# EAGLE design Un_AVR (EAGLE 6.5.0)
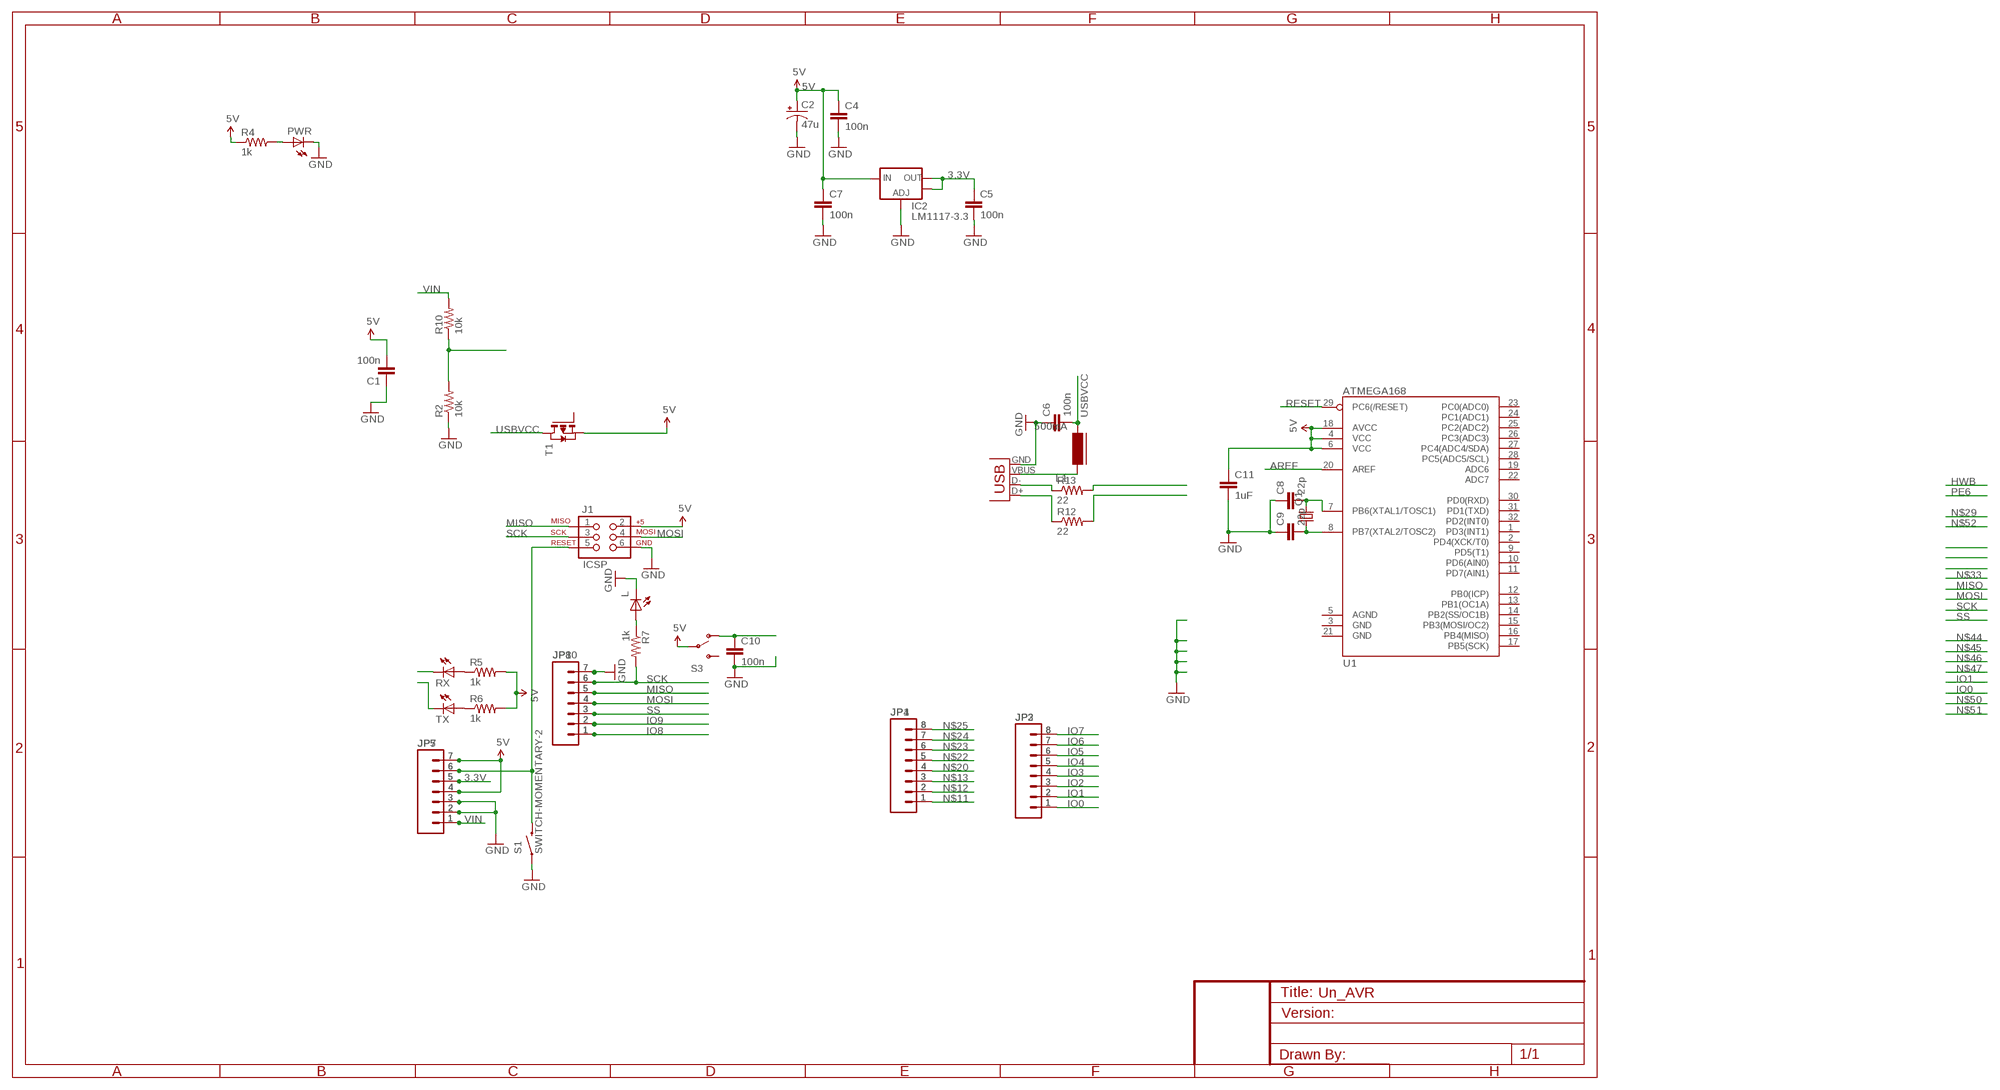
[diagram p0: schematic, sheet 1]

## Parts
C1  100n  CAP0603-CAP  [0603-CAP]
C2  47u  CAP_POLD  [PANASONIC_D]
C4  100n  CAP0603-CAP  [0603-CAP]
C5  100n  CAP0603-CAP  [0603-CAP]
C6  100n  CAP0603-CAP  [0603-CAP]
C7  100n  CAP0603-CAP  [0603-CAP]
C8  22p  CAP0603-CAP  [0603-CAP]
C9  22p  CAP0603-CAP  [0603-CAP]
C10  100n  CAP0603-CAP  [0603-CAP]
C11  1uF  CAP0603-CAP  [0603-CAP]
IC2  LM1117-3.3  V_REG_LM1117SOT223  [SOT223]
J1  ICSP  AVR_SPI_PRG_6PTH  [2X3]
JP1  M081X08  [1X08]
JP2  M081X08  [1X08]
JP3  M081X08  [1X08]
JP4  M081X08  [1X08]
JP5  M07  [1X07]
JP7  M07  [1X07]
JP8  M07  [1X07]
JP10  M07  [1X07]
L  LED0805  [LED-0805]
L1  500mA  FERRITE-0805  [FB805]
PWR  LED0805  [LED-0805]
Q1  CRYSTALHC49US  [HC49US]
R2  10k  RESISTOR0805-RES  [0805]
R4  1k  RESISTOR0805-RES  [0805]
R5  1k  RESISTOR0805-RES  [0805]
R6  1k  RESISTOR0805-RES  [0805]
R7  1k  RESISTOR0805-RES  [0805]
R10  10k  RESISTOR0805-RES  [0805]
R12  22  RESISTOR0805-RES  [0805]
R13  22  RESISTOR0805-RES  [0805]
RX  LED0805  [LED-0805]
S1  SWITCH-MOMENTARY-2  [TACTILE_SWITCH_TALL]
S3  SWITCH-SPSTPTH  [SWITCH-SPDT]
T1  PMOSSOT23  [SOT-23]
TX  LED0805  [LED-0805]
U1  ATMEGA168  [TQFP32-08]
X1  USBSMD  [USB-MINIB]

## Nets
3.3V: C5.1 IC2.2(OUT) IC2.4(OUT) JP5.5 JP7.5
5V: C1.2 C2.+ C4.1 C7.1 C11.1 IC2.3(IN) J1.2 JP5.4 JP5.7 JP7.4 JP7.7 R4.1 R5.2 R6.2 S3.2(P) T1.2(S) U1.4(VCC) U1.6(VCC) U1.18(AVCC)
AREF: U1.20(AREF)
GND [gnd]: C1.1 C2.- C4.2 C5.2 C6.1 C7.2 C8.1 C9.1 C10.2 C11.2 IC2.1(ADJ) J1.6 JP5.2 JP5.3 JP7.2 JP7.3 JP8.7 JP10.7 L.2(C) PWR.2(C) R2.1 S1.A2 X1.GND
IO0: JP2.1 JP3.1
IO1: JP2.2 JP3.2
IO2: JP2.3 JP3.3
IO3: JP2.4 JP3.4
IO4: JP2.5 JP3.5
IO5: JP2.6 JP3.6
IO6: JP2.7 JP3.7
IO7: JP2.8 JP3.8
IO8: JP8.1 JP10.1
IO9: JP8.2 JP10.2
MISO: J1.1 JP8.5 JP10.5
MOSI: J1.4 JP8.4 JP10.4
N$1: R2.2 R10.1
N$3: L1.1 X1.VBUS
N$5: R13.1 X1.D-
N$6: R13.2
N$7: R5.1 RX.1(A)
N$8: R6.1 TX.1(A)
N$9: RX.2(C)
N$10: TX.2(C)
N$11: JP1.1 JP4.1
N$12: JP1.2 JP4.2
N$13: JP1.3 JP4.3
N$14: L.1(A) R7.1
N$15: C10.1 S3.1(O)
N$18: R12.2
N$19: R12.1 X1.D+
N$20: JP1.4 JP4.4
N$22: JP1.5 JP4.5
N$23: JP1.6 JP4.6
N$24: JP1.7 JP4.7
N$25: JP1.8 JP4.8
N$34: PWR.1(A) R4.2
N$38: J1.5 JP5.6 JP7.6 S1.B2
N$39: C8.2 Q1.2 U1.7(PB6(XTAL1/TOSC1))
N$40: C9.2 Q1.1
RESET: U1.29(PC6(/RESET))
SCK: J1.3 JP8.6 JP10.6 R7.2
SS: JP8.3 JP10.3
USBVCC: C6.2 L1.2 T1.1(D)
VIN: JP5.1 JP7.1 R10.2
Unconnected: S3.3(S) T1.3(G) U1.1(PD3(INT1)) U1.2(PD4(XCK/T0)) U1.3(GND) U1.5(AGND) U1.8(PB7(XTAL2/TOSC2)) U1.9(PD5(T1)) U1.10(PD6(AIN0)) U1.11(PD7(AIN1)) U1.12(PB0(ICP)) U1.13(PB1(OC1A)) U1.14(PB2(SS/OC1B)) U1.15(PB3(MOSI/OC2)) U1.16(PB4(MISO)) U1.17(PB5(SCK)) U1.19(ADC6) U1.21(GND) U1.22(ADC7) U1.23(PC0(ADC0)) U1.24(PC1(ADC1)) U1.25(PC2(ADC2)) U1.26(PC3(ADC3)) U1.27(PC4(ADC4/SDA)) U1.28(PC5(ADC5/SCL)) U1.30(PD0(RXD)) U1.31(PD1(TXD)) U1.32(PD2(INT0))

## Library data of the parts
C1 C4-C11 = 2SparkFun:CAP: Capacitor Standard 0603 ceramic capacitor, and 0.1" leaded capacitor.
C2 = 1SparkFun:CAP_POL: Capacitor Polarized These are standard SMD and PTH capacitors. Normally 10uF, 47uF, and 100uF in electrolytic and tantalum varieties. Always verify the external diameter of the through hole cap, it varies with capacity, voltage, and manufacturer. The EIA devices should be standard.
IC2 = 1SparkFun:V_REG_LM1117: Voltage Regulator LM1117 Standard adjustable voltage regulator but in SMD form. Spark Fun Electronics SKU : COM-00595
J1 = 1SparkFun:AVR_SPI_PRG_6: AVR ISP 6 Pin This is the reduced ISP connector for AVR programming. Common on Arduino. This footprint will take up less PCB space and can be used with a 10-pin to 6-pin adapter such as SKU: BOB-08508
JP1-JP4 = 2SparkFun:M08: Header 8 Standard 8-pin 0.1" header. Use with straight break away headers (SKU : PRT-00116), right angle break away headers (PRT-00553), swiss pins (PRT-00743), machine pins (PRT-00117), and female headers (PRT-00115).
JP5 JP7 JP8 JP10 = 2SparkFun:M07: Header 7 Standard 7-pin 0.1" header. Use with straight break away headers (SKU : PRT-00116), right angle break away headers (PRT-00553), swiss pins (PRT-00743), machine pins (PRT-00117), and female headers (PRT-00115). NOTES ON THE VARIANTS LOCK and LOCK_LONGPADS... This footprint was designed to help hold the alignment of a through-hole component (i.e. 7-pin header) while soldering it into place. You may notice that each hole has been shifted either up or down by 0.005 of an inch from it's more standard position (which is usually a perfectly straight line). This slight alteration caused the pins (the squares in the middle) to touch the edges of the holes. Because they are alternating, it causes a "brace" to hold the header in place. 0.005 has proven to be the perfect amount of "off-center" position when using our standard breakaway headers. Although looks a little odd when you look at the bare footprint, once you have a header in there, the alteration is very hard to notice. Also, if you push a header all the way into place, it is covered up entirely on the bottom side. This idea of altering the position of holes to aid alignment will be further integrated into the Sparkfun Library for other footprints. It can help hold any component with 3 or more connection pins.
L PWR RX TX = 1SparkFun:LED: LEDs Standard schematic elements and footprints for 5mm, 3mm, 1206, and 0603 sized LEDs. 5mm - Spark Fun Electronics SKU : COM-00529 (and others)
L1 = 2SparkFun:FERRITE: Ferrite bead in various packages
Q1 = 1SparkFun:CRYSTAL: Crystals Various standard crystals. Proven footprints. Spark Fun Electronics SKU : COM-00534
R2 R4-R7 R10 R12 R13 = 2SparkFun:RESISTOR: Resistor Basic schematic elements and footprints for 0603, 1206, and PTH resistors.
S1 = 2SparkFun:SWITCH-MOMENTARY-2
S3 = 2SparkFun:SWITCH-SPST: SPST Switch Simple slide switch. Spark Fun Electronics SKU : COM-00102
T1 = zetex:PMOSSOT23: MOS FET; OC_FARNELL: unknown; OC_NEWARK: unknown
U1 = 2SparkFun:ATMEGA168
X1 = 2SparkFun:USB: USB Connectors USB-B-PTH is fully proven SKU : PRT-00139 USB-miniB is fully proven SKU : PRT-00587 USB-A-PCB is untested. USB-A-H is throughly reviewed, but untested. Spark Fun Electronics SKU : PRT-00437 USB-B-SMT is throughly reviewed, but untested. Needs silkscreen touching up. USB-A-S has not been used/tested USB-MB-H has not been used/tested

## Net classes
0 default: width 0.254 mm, clearance 0.254 mm
1 power: width 0.61 mm, drill 0.61 mm, clearance 0.254 mm
2 gnd: width 0.305 mm, drill 0.559 mm, clearance 0.254 mm
3 usbvcc: width 0.508 mm, drill 0.61 mm, clearance 0.254 mm
4 aref: width 0.406 mm, drill 0.61 mm, clearance 0.254 mm

## Board
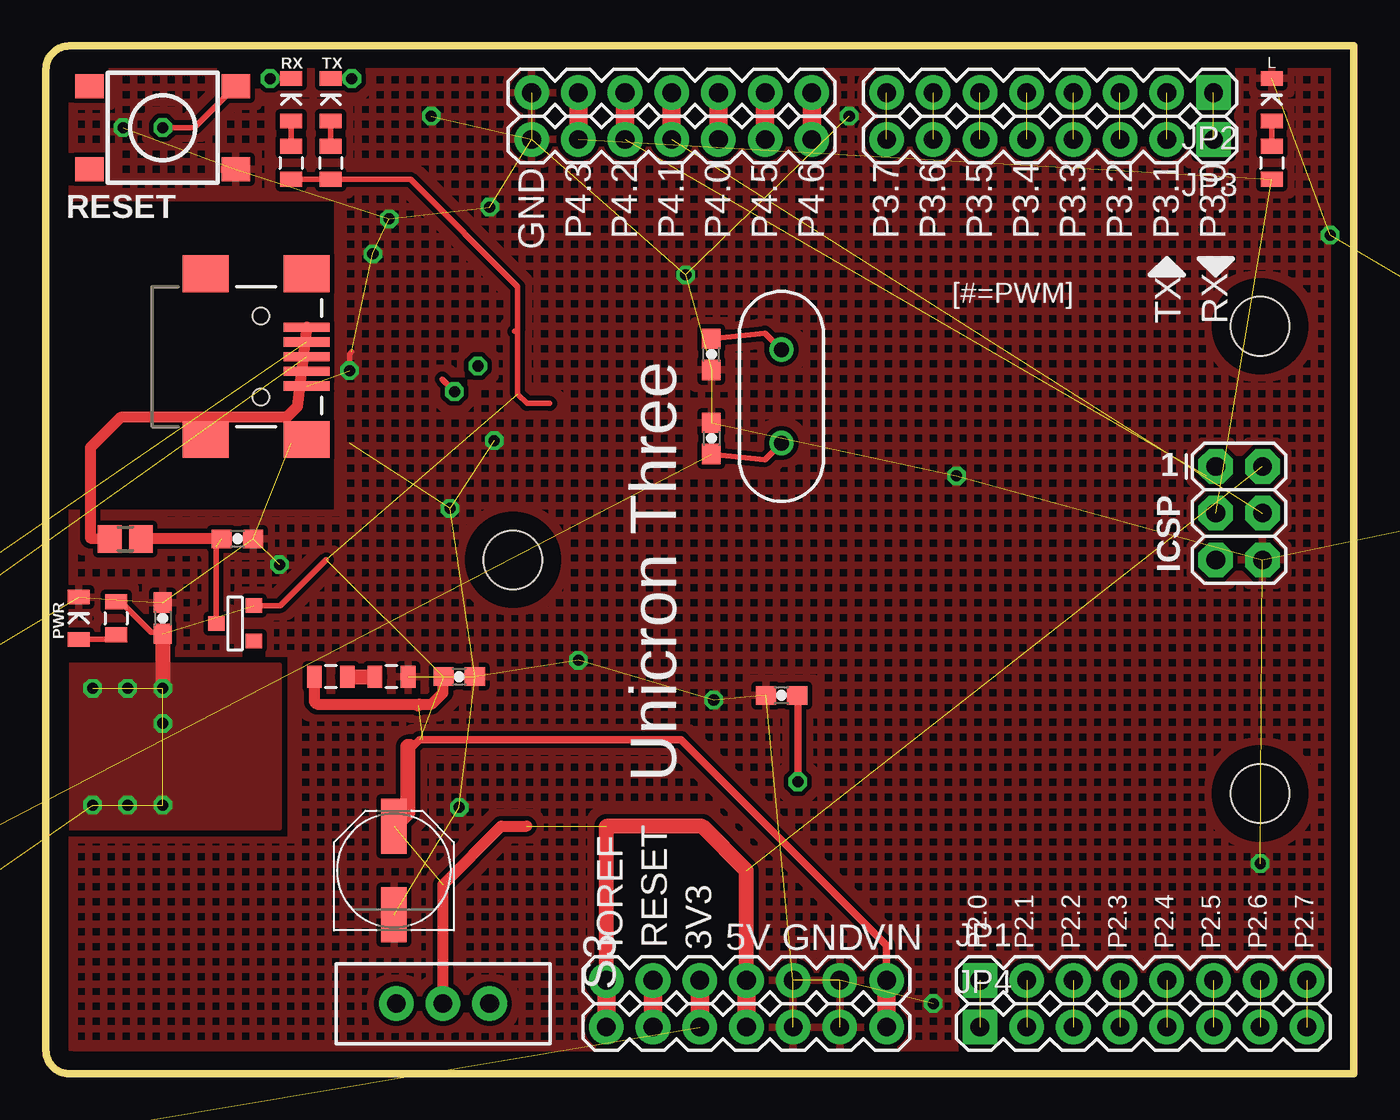
[diagram p1: board, top side]
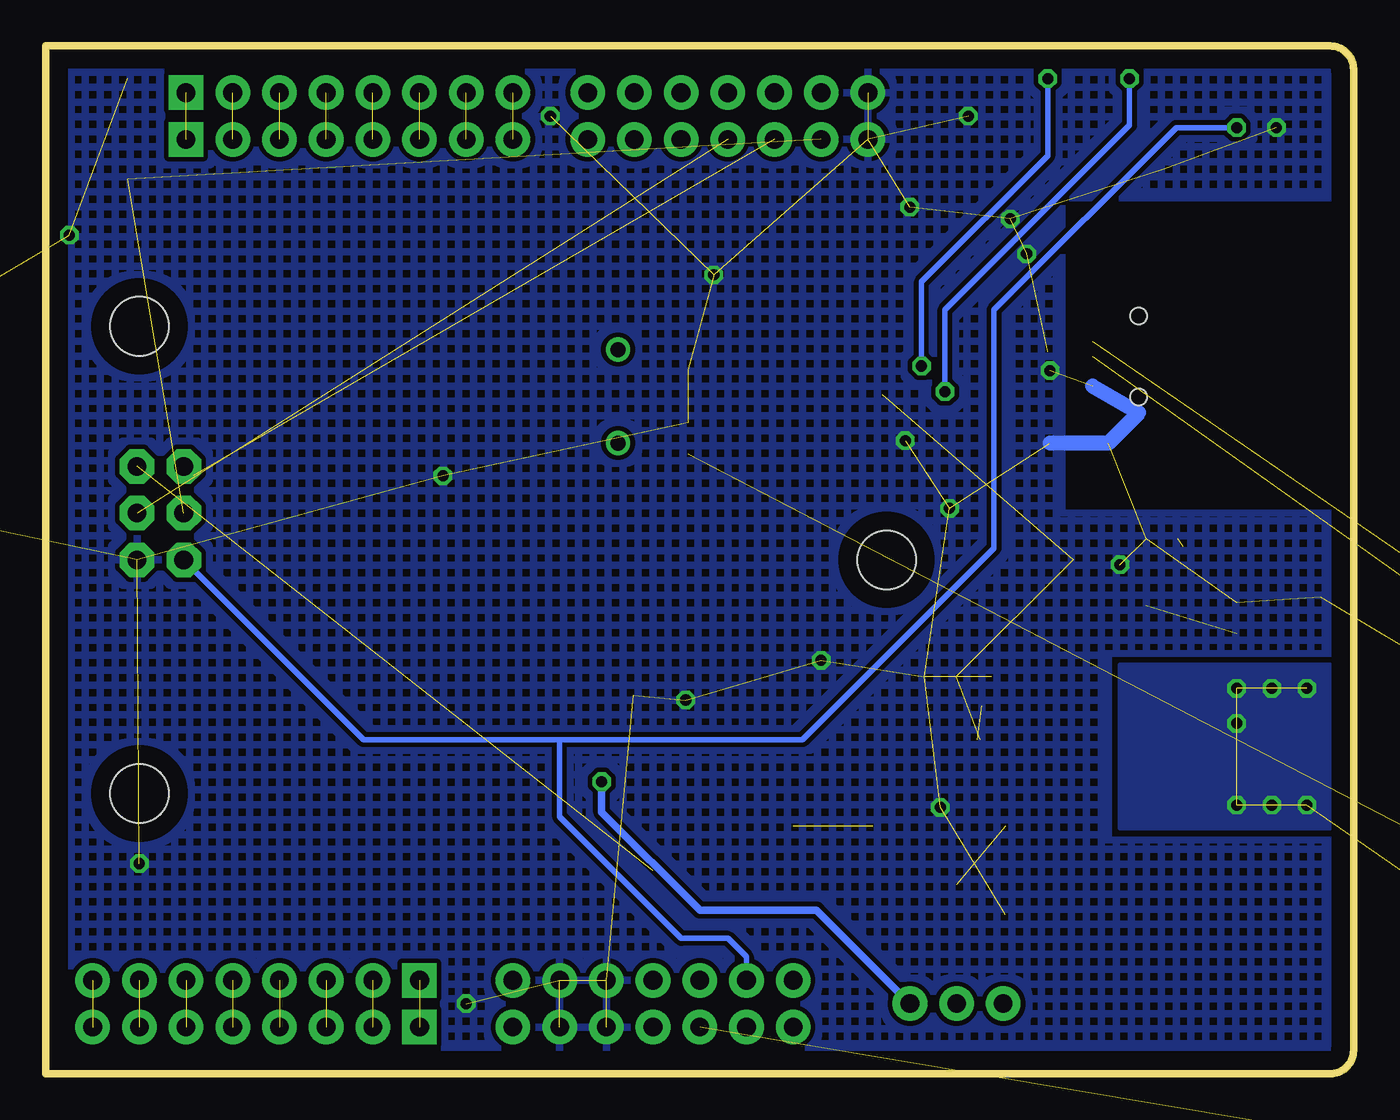
[diagram p2: board, bottom side, seen from below]

Size 71.12 x 55.88 mm. Coordinates in mm from the lower left corner, seen from the top.
Outline: 1.27,0 71.12,0 71.12,55.88 1.27,55.88 arc90 0,54.61 0,1.27 arc90 1.27,0
Copper layers (1*16): Top 0.035mm / dielectric 1.5mm / Bottom 0.035mm
Design rules "default": minimum track width 10mil, minimum drill 24mil, track to track 8mil, track to pad 8mil, pad to pad 8mil, via to via 8mil, smd to smd 8mil, copper to edge 40mil, drill to drill 8mil, minimum pad ring 10mil, minimum via ring 8mil, stop-mask expansion 4mil, vias tented up to drill 0mil, thermal gap 10mil
Holes 3.2 mm at 66.04,40.64 66.04,15.24 25.4,27.94

### Footprints (pad centres in the part's own frame; a part is rotated, then mirrored left to right if it is on the bottom)
0603-CAP = smd 1.1 x 1: 1 -0.85,0; 2 0.85,0
PANASONIC_D = smd 3 x 1.4: + 2.4,0; - -2.4,0
SOT223 = smd 1.219 x 2.235: 1 -2.311,-3.099; 2 0,-3.099; 3 2.311,-3.099 | smd 3.6 x 2.2: 4 0,3.099
2X3 = drill 1.016 pad 1.88 octagon: 1 0,0; 2 0,2.54; 3 2.54,0; 4 2.54,2.54; 5 5.08,0; 6 5.08,2.54
1X08 = drill 1.016 pad 1.88 square: 1 0,0 | drill 1.016 pad 1.88: 2 2.54,0; 3 5.08,0; 4 7.62,0; 5 10.16,0; 6 12.7,0; 7 15.24,0; 8 17.78,0
1X07 = drill 1.016 pad 1.88: 1 0,0; 2 2.54,0; 3 5.08,0; 4 7.62,0; 5 10.16,0; 6 12.7,0; 7 15.24,0
LED-0805 = smd 0.8 x 1.2: 1 -1.154,0; 2 1.154,0
FB805 = smd 1.3 x 1.5: 1 -0.85,0; 2 0.85,0
HC49US = drill 0.813: 1 -2.54,0; 2 2.54,0
0805 = smd 0.8 x 1.2: 1 -0.9,0; 2 0.9,0
TACTILE_SWITCH_TALL = smd 1.55 x 1.3: A1 -3.975,-2.25; A2 3.975,-2.25; B1 -3.975,2.25; B2 3.975,2.25
SWITCH-SPDT = drill 1.016 pad 1.88: 1 0,2.54; 2 0,0; 3 0,-2.54
SOT-23 = smd 0.787 x 0.889: 1 0.025,-1.016; 2 -0.94,1.016; 3 0.991,1.016
TQFP32-08 = smd 1.27 x 0.559: 1 -4.293,2.8; 2 -4.293,2; 3 -4.293,1.2; 4 -4.293,0.4; 5 -4.293,-0.4; 6 -4.293,-1.2; 7 -4.293,-2; 8 -4.293,-2.8; 17 4.293,-2.8; 18 4.293,-2; 19 4.293,-1.2; 20 4.293,-0.4; 21 4.293,0.4; 22 4.293,1.2; 23 4.293,2; 24 4.293,2.8 | smd 0.559 x 1.27: 9 -2.8,-4.293; 10 -2,-4.293; 11 -1.2,-4.293; 12 -0.4,-4.293; 13 0.4,-4.293; 14 1.2,-4.293; 15 2,-4.293; 16 2.8,-4.293; 25 2.8,4.293; 26 2,4.293; 27 1.2,4.293; 28 0.4,4.293; 29 -0.4,4.293; 30 -1.2,4.293; 31 -2,4.293; 32 -2.8,4.293
USB-MINIB = smd 2.5 x 0.5: D+ 2.5,0; D- 2.5,0.8; GND 2.5,-1.6; ID 2.5,-0.8; VBUS 2.5,1.6 | smd 2.5 x 2: MTN1 -3,4.5; MTN2 2.5,4.5; MTN3 -3,-4.5; MTN4 2.5,-4.5 | hole 0.9: 0,2.2; 0,-2.2

### Placement (x,y rotation side)
C1  6.35,24.77 270 top
C2  18.92,11.05 90 top
C4  22.48,21.59 0 top
C5  -57.15,-24.77 0 top  (outside the outline)
C6  10.41,29.08 180 top
C7  -48.89,-21.59 0 top  (outside the outline)
C8  36.19,34.54 270 top
C9  36.19,39.12 90 top
C10  40,20.57 180 top
C11  -57.15,-8.89 0 top  (outside the outline)
IC2  -55.24,-15.88 0 top  (outside the outline)
J1  63.63,33.02 270 top
JP1  50.8,5.08 0 top
JP2  63.5,53.34 180 top
JP3  63.5,50.8 180 top
JP4  50.8,2.54 0 top
JP5  45.72,2.54 180 top
JP7  45.72,5.08 180 top
JP8  41.66,50.8 180 top
JP10  41.66,53.34 180 top
L  66.68,52.96 90 top
L1  4.32,29.08 0 top
PWR  1.78,24.77 90 top
Q1  40,36.83 270 top
R2  18.8,21.59 180 top
R4  3.81,24.77 270 top
R5  13.33,49.53 270 top
R6  15.49,49.53 270 top
R7  66.68,49.53 270 top
R10  15.49,21.59 180 top
R12  -40.64,-0.64 0 top  (outside the outline)
R13  -43.81,-0.64 0 top  (outside the outline)
RX  13.33,52.96 90 top
S1  6.35,51.44 0 top
S3  21.59,3.81 270 top
T1  10.29,24.51 270 top
TX  15.49,52.96 90 top
U1  -64.77,-19.05 0 top  (outside the outline)
X1  11.68,38.99 0 top

### Tracks (layer width: path | path; a pad name or v marks a point on that pad's centre or on a via)
3.3V  (3 unrouted)
  Top 1.016: JP7.5 JP5.5
5V  (via drill 0.6)  (19 unrouted)
  Top 0.305: R4.1 4.05,25.66 5.72,24 6.26,24 C1.2 | T1.2 12.75,25.45 15.24,27.94 | R5.2 15.23,48.63 15.37,48.77 15.37,48.76 R6.2 19.82,48.63 25.65,42.8 25.65,40.51 | 25.5,40.36 arc90 25.65,40.51 | 27.39,36.45 26.16,36.45 25.65,36.96 25.65,40.51
  Top 0.406: 19.69,14.21 19.69,17.53 20.32,18.16
  Top 0.61: S3.2 21.59,10.29 24.77,13.46 26.15,13.46 | 19.81,17.91 19.69,17.78
  Top 0.813: C1.2 v6.35,20.95 | JP7.4 38.1,11.05 35.7,13.45 30.48,13.45 JP7.7 | C2.+ 19.69,14.21 19.69,17.78
  Top 1.016: JP7.4 JP5.4 | JP5.7 JP7.7
  other vias: 4.44,20.95 6.35,19.05 6.35,14.61 4.44,14.61 2.54,14.61 2.54,20.95
  pour Bottom: 1.27,22.23 12.7,22.23 12.7,13.34 1.27,13.34
  pour Top: 1.27,13.34 12.7,13.34 12.7,22.23 1.27,22.23
GND  (via drill 0.6)  (43 unrouted)
  Top 0.305: v16.51,38.23 16.51,39.12 16.64,39.24
  Bottom 0.813: X1.GND 11.68,35.94 13.33,34.29 16.51,34.29
  other vias: 17.78,44.58 22.48,14.48 34.8,43.43 48.26,3.81 21.97,30.73 28.96,22.48 24.38,34.42 20.95,52.07 83.69,31.62 24.13,47.12 36.32,20.32 83.19,37.72 69.85,45.59 43.69,52.07 66.04,11.43 49.53,32.51 12.7,27.69 4.19,51.44 18.67,46.48
  pour Top (hatched): 0,55.88 71.12,55.88 71.12,0 0,0 0,12.7 13.33,12.7 13.33,22.86 0,22.86 0,30.48 15.88,30.48 15.88,47.62 0,47.62
  pour Bottom (hatched): 0,55.88 71.12,55.88 71.12,0 0,0 0,12.7 13.33,12.7 13.33,22.86 0,22.86 0,30.48 15.88,30.48 15.88,47.62 0,47.62
IO0  (1 unrouted)
IO1  (1 unrouted)
IO2  (1 unrouted)
IO3  (1 unrouted)
IO4  (1 unrouted)
IO5  (1 unrouted)
IO6  (1 unrouted)
IO7  (1 unrouted)
IO8
  Top 1.016: JP10.1 JP8.1
IO9
  Top 0.305: JP8.2 39.12,50.67 39.24,50.55
  Top 1.016: JP8.2 JP10.2
MISO  (1 unrouted)
  Top 0.305: 63.12,32.51 J1.1
  Top 1.016: JP10.5 JP8.5
MOSI  (1 unrouted)
  Top 1.016: JP10.4 JP8.4
N$1
  Top 0.406: 17.78,21.71 R2.2
  Top 0.813: R10.1 R2.2
N$3
  Top 0.61: X1.VBUS 13.67,36.27 13.08,35.69 4.06,35.69 2.41,34.04 2.41,29.13 L1.1
N$5  (1 unrouted)
N$7
  Top 0.305: RX.1 R5.1
N$8
  Top 0.305: R6.1 TX.1
N$9  (via drill 0.6)
  Top 0.305: RX.2 12.2,54.11 v12.19,54.1 | 21.55,37.76 v22.22,37.08
  Bottom 0.305: v12.19,54.1 12.19,51.56 22.22,41.53 v22.22,37.08
N$10  (via drill 0.6)
  Top 0.305: TX.2 16.5,54.11 v16.64,54.1 | 23.42,38.41 v23.5,38.48
  Bottom 0.305: v16.64,54.1 16.64,49.91 23.5,43.05 v23.5,38.48
N$11  (1 unrouted)
N$12  (1 unrouted)
N$13  (1 unrouted)
N$14
  Top 0.305: L.1 R7.1
N$15  (via drill 0.6)
  Top 0.305: 40.89,20.54 C10.1
  Top 0.406: v40.89,15.88 40.89,20.54
  Bottom 0.406: S3.1 29.21,8.89 35.56,8.89 40.89,14.22 v40.89,15.88
N$19  (1 unrouted)
N$20  (1 unrouted)
N$22  (1 unrouted)
N$23  (1 unrouted)
N$24  (1 unrouted)
N$25  (1 unrouted)
N$34
  Top 0.305: PWR.1 3.56,23.61 R4.2
N$38  (via drill 0.6)
  Top 0.305: 10.03,53.85 10.2,53.69 S1.B2 8.08,51.44 v6.35,51.44
  Top 1.016: JP5.6 JP7.6
  Bottom 0.305: JP7.6 33.02,6.35 34.04,7.37 36.58,7.37 43.18,13.97 43.18,18.16 | J1.5 53.85,18.16 43.18,18.16 | v6.35,51.44 9.65,51.44 19.56,41.53 19.56,28.57 29.97,18.16 43.18,18.16
N$39  (1 unrouted)
  Top 0.305: 40.18,34.11 Q1.2 39.11,33.39 C8.2
N$40
  Top 0.305: C9.2 39.11,40.27 Q1.1
SCK  (2 unrouted)
  Top 1.016: JP10.6 JP8.6
SS
  Top 1.016: JP10.3 JP8.3
USBVCC  (1 unrouted)
  Top 0.305: T1.1 9.27,28.66
  Top 0.61: C6.2 L1.2
VIN  (1 unrouted)
  Top 0.406: JP7.1 45.72,6.99 34.54,18.16 20.49,18.16
  Top 0.61: R10.2 14.59,20.23 14.73,20.09 20.32,20.09 | 20.32,20.09 20.98,20.09 21.59,20.7 21.59,21.55 | 20.23,20 20.32,20.09
  Top 1.016: JP7.1 JP5.1

### Text on the board
tPlace: P4.2 | P4.1 | P4.0 | P4.5 | P4.6 | P3.7 | P3.6 | P3.5 | P3.4 | P3.3 | P3.2 | P3.1 | P3.0 | Unicron Three
tNames: RX | TX | P4.3 | GND | RESET | [#=PWM] | TX | RX | 1 | ICSP | PWR | IOREF | RESET | 3V3 | 5V | GND | VIN | P2.0 | P2.1 | P2.2 | P2.3 | P2.4 | P2.5 | P2.6 | P2.7